# Altium schematic sheet CAMERA_CSI_RPIv2.SchDoc
size A3; SheetNumber: 6; SheetTotal: 7
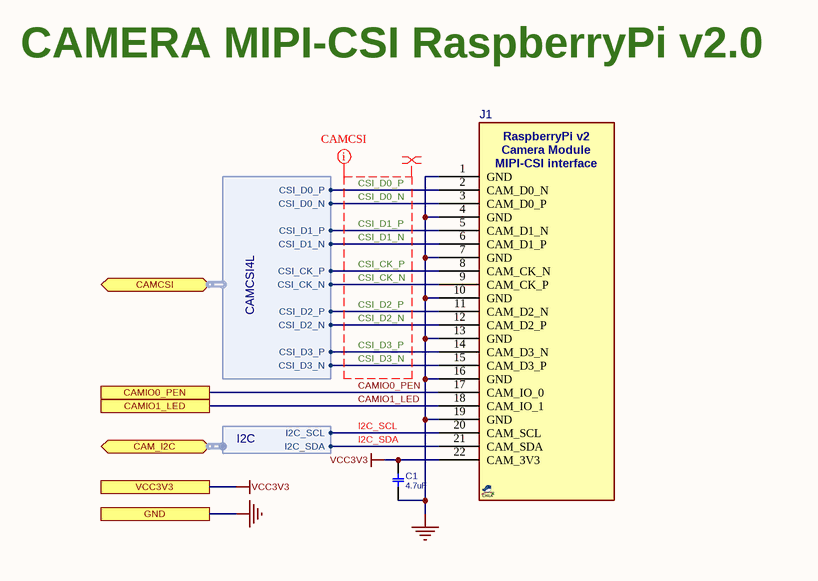
[diagram p0: CAMERA_CSI_RPIv2.SchDoc]

## Parts
C1  4.7uF  [C0402]
J1  RPICAM_V2  [FPC50_22B]  (value not drawn)

## Ports
CAM_I2C (bidir, harness I2C), CAMCSI (bidir, harness CAMCSI4L), CAMIO0_PEN, CAMIO1_LED, GND, VCC3V3

## Harnesses
CAMCSI4L: CSI_D0_P, CSI_D0_N, CSI_D1_P, CSI_D1_N, CSI_CK_P, CSI_CK_N, CSI_D2_P, CSI_D2_N, CSI_D3_P, CSI_D3_N
I2C: I2C_SCL, I2C_SDA

## Nets
GND: C1.1 J1.1(GND) J1.4(GND) J1.7(GND) J1.10(GND) J1.13(GND) J1.16(GND) J1.19(GND) ; port GND
VCC3V3: C1.2 J1.22(CAM_3V3) ; port VCC3V3
CAMIO0_PEN: J1.17(CAM_IO_0) ; port CAMIO0_PEN
CAMIO1_LED: J1.18(CAM_IO_1) ; port CAMIO1_LED
CSI_CK_N: J1.9(CAM_CK_P) ; port CAMCSI.CSI_CK_N
CSI_CK_P: J1.8(CAM_CK_N) ; port CAMCSI.CSI_CK_P
CSI_D0_N: J1.3(CAM_D0_P) ; port CAMCSI.CSI_D0_N
CSI_D0_P: J1.2(CAM_D0_N) ; port CAMCSI.CSI_D0_P
CSI_D1_N: J1.6(CAM_D1_P) ; port CAMCSI.CSI_D1_N
CSI_D1_P: J1.5(CAM_D1_N) ; port CAMCSI.CSI_D1_P
CSI_D2_N: J1.12(CAM_D2_P) ; port CAMCSI.CSI_D2_N
CSI_D2_P: J1.11(CAM_D2_N) ; port CAMCSI.CSI_D2_P
CSI_D3_N: J1.15(CAM_D3_P) ; port CAMCSI.CSI_D3_N
CSI_D3_P: J1.14(CAM_D3_N) ; port CAMCSI.CSI_D3_P
I2C_SCL: J1.20(CAM_SCL) ; port CAM_I2C.I2C_SCL
I2C_SDA: J1.21(CAM_SDA) ; port CAM_I2C.I2C_SDA

## Layout directives
net class CAMDVP: CSI_CK_N, CSI_CK_P, CSI_D0_N, CSI_D0_P, CSI_D1_N, CSI_D1_P, CSI_D2_N, CSI_D2_P, CSI_D3_N, CSI_D3_P
differential pair: CSI_CK_N, CSI_CK_P, CSI_D0_N, CSI_D0_P, CSI_D1_N, CSI_D1_P, CSI_D2_N, CSI_D2_P, CSI_D3_N, CSI_D3_P

## Notes on the sheet
- CAMERA MIPI-CSI RaspberryPi v2.0
- (in symbol RPICAM_V2_FPC22) RaspberryPi v2; Camera Module; MIPI-CSI interface

## Library data of the parts
C1 = CAP_SMD_MLCC: CAP, MLCC; PARAM: X5R, 20%; MANF_P#: LMK105BBJ475MVLF; MANF: Taiyo Yuden; PARAM2: 10v; PRICE: 10,000: $0.034; ASSEMBLY: ASSEMBLY; VALUE: 4.7uF
J1 = RPICAM_V2_FPC22: Camera Module, Color, MIPI-CSI FPC22; PARAM2: 3.3v; PARAM: RaspberryPi v2 camera module; VALUE: RPICAM_V2; MANF_P#: RPICAM_V2